# EAGLE design sensor_board_v0.53 (EAGLE 7.7.0)
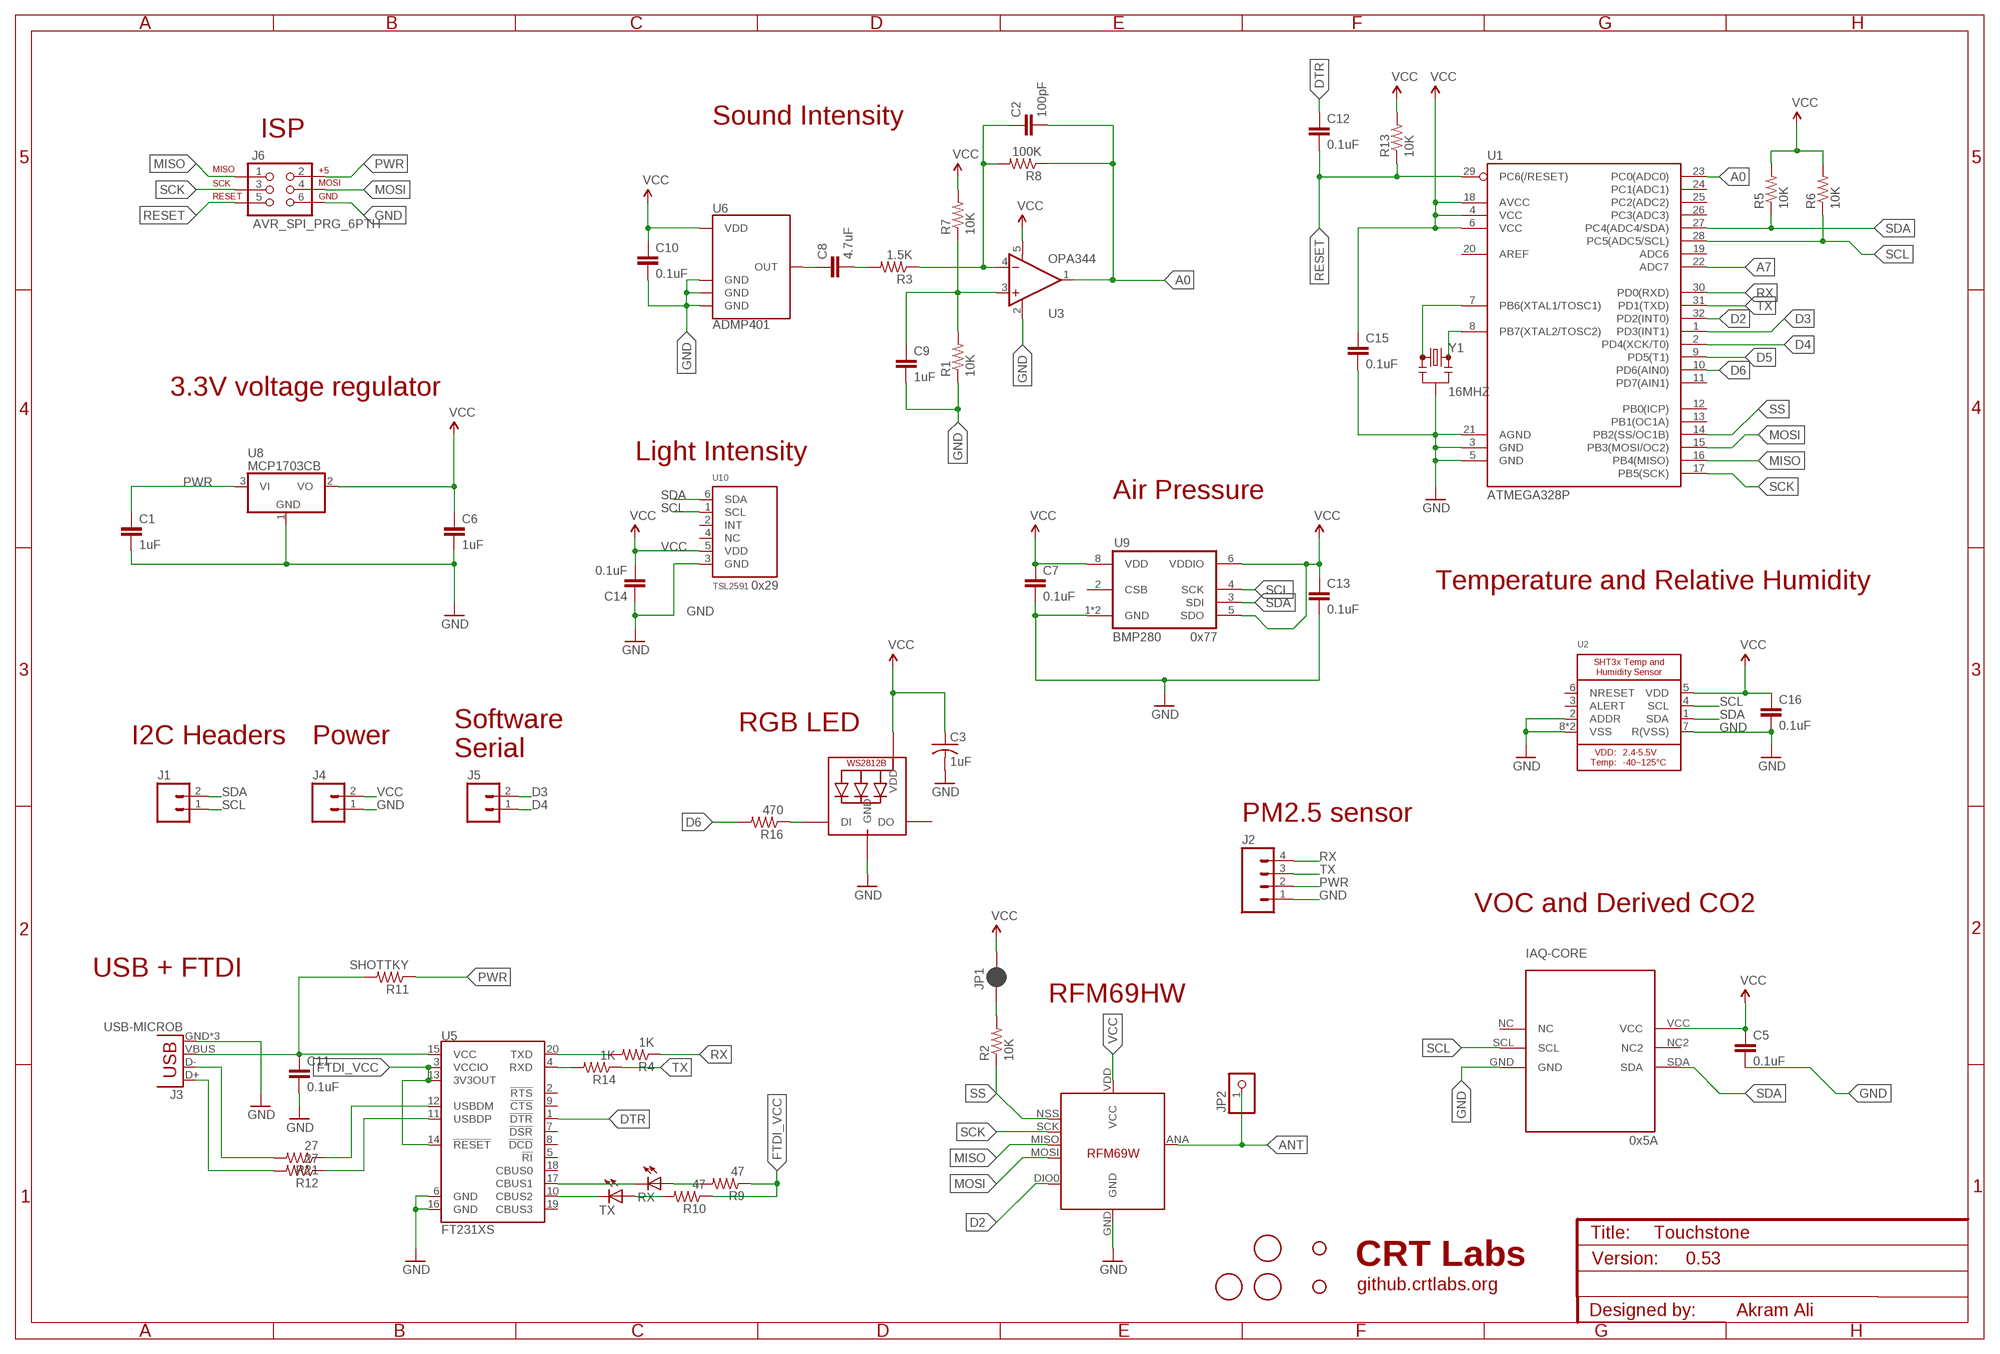
[diagram p0: schematic, sheet 1]

## Parts
C1  1uF  CAP0805  [0805]
C2  100pF  CAP0805  [0805]
C3  1uF  C-USC0603K  [C0603K]
C5  0.1uF  CAP0805  [0805]
C6  1uF  CAP0805  [0805]
C7  0.1uF  CAP0805  [0805]
C8  4.7uF  CAP0805  [0805]
C9  1uF  CAP0805  [0805]
C10  0.1uF  CAP0805  [0805]
C11  0.1uF  CAP0805  [0805]
C12  0.1uF  CAP0805  [0805]
C13  0.1uF  CAP0805  [0805]
C14  0.1uF  CAP0805  [0805]
C15  0.1uF  CAP0805  [0805]
C16  0.1uF  CAP0805  [0805]
H1  STAND-OFF  [STAND-OFF]
H2  STAND-OFF  [STAND-OFF]
IAQ-CORE  IAQ-CORE  [IAQ-CORE]
J1  M02PTH  [1X02]
J2  M04PTH  [1X04]
J3  USB-MICROB  [USB-MICROB]
J4  M02PTH  [1X02]
J5  M02PTH  [1X02]
J6  AVR_SPI_PRG_6PTH  [2X3]
JP1  JUMPER-PAD-2-NC_BY_PASTEFULL-BOX-SILK  [PAD-JUMPER-2-NC_BY_PASTE_YES_SILK_FULL_BOX]
JP2  PINHD-1X1  [1X01]
LED1  WS2812B3535  [LED3535]
R1  10K  RESISTOR0805-RES  [0805]
R2  10K  RESISTOR0805-RES  [0805]
R3  1.5K  RESISTOR0805-RES  [0805]
R4  1K  RESISTOR0805-RES  [0805]
R5  10K  RESISTOR0805-RES  [0805]
R6  10K  RESISTOR0805-RES  [0805]
R7  10K  RESISTOR0805-RES  [0805]
R8  100K  RESISTOR0805-RES  [0805]
R9  47  RESISTOR0805-RES  [0805]
R10  47  RESISTOR0805-RES  [0805]
R11  SHOTTKY  RESISTOR0805-RES  [0805]
R12  27  RESISTOR0805-RES  [0805]
R13  10K  RESISTOR0805-RES  [0805]
R14  1K  RESISTOR0805-RES  [0805]
R16  470  R-US_R0603  [R0603]
R21  27  RESISTOR0805-RES  [0805]
RX  LEDCHIPLED_0805  [CHIPLED_0805]
TX  LEDCHIPLED_0805  [CHIPLED_0805]
U1  ATMEGA328P  ATMEGA328P_TQFP  [TQFP32-08]
U2  SHT3X  [SHT3X]
U3  OPA344  [SOT23-5]
U4  RFM69HW  LOWPOWERLAB_RFM69  [LOWPOWERLAB_RFM69W-MINPADS]
U5  FT231XS  [SSOP20_L]
U6  ADMP401  [ADMP401]
U8  MCP1703CB  [SOT23]
U9  BMP280  [BMP280]
U10  TSL2591  LIGHT_TSL2591  [DFN6_TAOS]
U$1  FIDUCIAL  [FIDUCIAL_1MM]
U$2  FIDUCIAL  [FIDUCIAL_1MM]
U$3  FIDUCIAL  [FIDUCIAL_1MM]
Y1  16MHZ  RESONATOR16MHZ  [RESONATOR-SMD]

## Nets
A0: C2.2 R8.1 U1.23(PC0(ADC0)) U3.1(OUT)
A7: U1.22(ADC7)
ANT: JP2.1 U4.ANA(ANT)
D2: U1.32(PD2(INT0)) U4.DIO0
D3: J5.2 U1.1(PD3(INT1))
D4: J5.1 U1.2(PD4(XCK/T0))
D5: U1.9(PD5(T1))
D6: R16.2 U1.10(PD6(AIN0))
DTR: C12.1 U5.1(!DTR)
FTDI_VCC: R9.1 R10.1 U5.3(VCCIO) U5.13(3V3OUT) U5.14(!RESET)
GND: C1.2 C3.2 C5.2 C6.2 C7.2 C9.2 C10.2 C11.2 C13.2 C14.1 C15.2 C16.2 IAQ-CORE.GND J2.1 J3.GND J3.MT1(GND) J3.MT2(GND) J4.1 J6.6 LED1.4(GND) R1.1 U1.3(GND) U1.5(GND) U1.21(AGND) U2.2(ADDR) U2.7(R(VSS)) U2.8(VSS) U2.THERMAL(VSS) U3.2(V-) U4.GND U5.6(GND) U5.16(GND) U6.2(GND) U6.4(GND) U6.6(GND) U8.1(GND) U9.1(GND) U9.7(GND) U10.3(GND) Y1.2
MISO: J6.1 U1.16(PB4(MISO)) U4.MISO
MOSI: J6.4 U1.15(PB3(MOSI/OC2)) U4.MOSI
N$1: JP1.1 R2.2
N$2: R14.2 U5.4(RXD)
N$3: R4.2 U5.20(TXD)
N$4: U1.8(PB7(XTAL2/TOSC2)) Y1.3
N$5: U1.7(PB6(XTAL1/TOSC1)) Y1.1
N$7: LED1.1(DI) R16.1
N$9: C8.2 R3.2
N$10: C2.1 R3.1 R8.2 U3.4(-IN)
N$11: C9.1 R1.2 R7.1 U3.3(+IN)
N$17: RX.C U5.17(CBUS1)
N$18: TX.C U5.10(CBUS2)
N$25: R21.1 U5.12(USBDM)
N$26: R12.1 U5.11(USBDP)
N$27: R9.2 RX.A
N$29: R10.2 TX.A
N$32: J3.D- R21.2
N$33: J3.D+ R12.2
OUT: C8.1 U6.1(OUT)
PWR: C1.1 J2.2 J6.2 R11.1 U8.3(VI)
RESET: C12.2 J6.5 R13.1 U1.29(PC6(/RESET))
RX: J2.4 R4.1 U1.30(PD0(RXD))
SCK: J6.3 U1.17(PB5(SCK)) U4.SCK
SCL: IAQ-CORE.SCL J1.1 R6.1 U1.28(PC5(ADC5/SCL)) U2.4(SCL) U9.4(SCK) U10.1(SCL)
SDA: IAQ-CORE.SDA J1.2 R5.1 U1.27(PC4(ADC4/SDA)) U2.1(SDA) U9.3(SDI) U10.6(SDA)
SS: R2.1 U1.14(PB2(SS/OC1B)) U4.NSS(SEL)
TX: J2.3 R14.1 U1.31(PD1(TXD))
VBUS: C11.1 J3.VBUS R11.2 U5.15(VCC)
VCC: C3.1 C5.1 C6.1 C7.1 C10.1 C13.1 C14.2 C15.1 C16.1 IAQ-CORE.VCC J4.2 JP1.2 LED1.2(VDD) R5.2 R6.2 R7.2 R13.2 U1.4(VCC) U1.6(VCC) U1.18(AVCC) U2.5(VDD) U3.5(V+) U4.VDD(VCC) U6.5(VDD) U8.2(VO) U9.5(SDO) U9.6(VDDIO) U9.8(VDD) U10.5(VDD)
Unconnected: IAQ-CORE.NC IAQ-CORE.NC2 LED1.3(DO) U1.11(PD7(AIN1)) U1.12(PB0(ICP)) U1.13(PB1(OC1A)) U1.19(ADC6) U1.20(AREF) U1.24(PC1(ADC1)) U1.25(PC2(ADC2)) U1.26(PC3(ADC3)) U2.3(ALERT) U2.6(NRESET) U5.2(!RTS) U5.5(!RI) U5.7(!DSR) U5.8(!DCD) U5.9(!CTS) U5.18(CBUS0) U5.19(CBUS3) U9.2(CSB) U10.2(INT) U10.4(NC)

## Notes on the sheet
- Sound Intensity
- ISP
- 3.3V voltage regulator
- Light Intensity
- Air Pressure
- 0x29 | Temperature and Relative Humidity
- 0x77
- RGB LED
- I2C Headers | Power
- Software
  Serial
- PM2.5 sensor
- VOC and Derived CO2
- USB + FTDI
- RFM69HW
- 0x5A
- Touchstone
- CRT Labs | 0.53
- github.crtlabs.org
- Akram Ali

## Library data of the parts
C1 C6 C9 = SparkFun-Capacitors:CAP: Capacitor Standard 0603 ceramic capacitor, and 0.1" leaded capacitor.; MPN: CC0805ZRY5V8BB105
C2 = SparkFun-Capacitors:CAP: Capacitor Standard 0603 ceramic capacitor, and 0.1" leaded capacitor.; MPN: CC0805JRNPOABN101
C3 = adafruit:C-US: CAPACITOR, American symbol; MPN: CC0805ZRY5V8BB105
C5 C7 C12-C16 = SparkFun-Passives:CAP: Capacitor Standard 0603 ceramic capacitor, and 0.1" leaded capacitor.; MPN: CC0805KRX7R9BB104
C8 = SparkFun-Capacitors:CAP: Capacitor Standard 0603 ceramic capacitor, and 0.1" leaded capacitor.; MPN: CC0805KKX7R6BB475
C10 C11 = SparkFun-Capacitors:CAP: Capacitor Standard 0603 ceramic capacitor, and 0.1" leaded capacitor.; MPN: CC0805KRX7R9BB104
H1 H2 = SparkFun-Electromechanical:STAND-OFF: #4 Stand Off This is the mechanical footprint for a #4 phillips button head screw. Use the keepout ring to avoid running the screw head into surrounding components. SKU : PRT-00447
IAQ-CORE = IAQ-CORE:IAQ-CORE; MPN: IAQ-CORE C; OC_NEWARK: 82Y5455
J1 J4 J5 = SparkFun-Connectors:M02: Standard 2-pin 0.1" header. Use with - straight break away headers ( PRT-00116) - right angle break away headers (PRT-00553) - swiss pins (PRT-00743) - machine pins (PRT-00117) - female headers (PRT-00115) Molex polarized connector foot print use with: PRT-08233 with associated crimp pins and housings. 2.54_SCREWTERM for use with PRT-10571. 3.5mm Screw Terminal footprints for PRT-08084 5mm Screw Terminal footprints for use with PRT-08432
J2 = SparkFun-Connectors:M04: Header 4 Standard 4-pin 0.1" header. Use with straight break away headers (SKU : PRT-00116), right angle break away headers (PRT-00553), swiss pins (PRT-00743), machine pins (PRT-00117), and female headers (PRT-00115). Molex polarized connector foot print use with SKU : PRT-08231 with associated crimp pins and housings. 1MM SMD Version SKU: PRT-10208; PROD_ID: CONN-09696
J3 = SparkFun-Connectors:USB: USB Connectors USB-B-PTH is fully proven SKU : PRT-00139/CONN-08278 USB-miniB is fully proven SKU : PRT-00587 USB-A-PCB is untested. USB-A-H is throughly reviewed, but untested. Spark Fun Electronics SKU : PRT-00437 USB-B-SMT is throughly reviewed, but untested. Needs silkscreen touching up. USB-A-S has not been used/tested USB-MB-H has not been used/tested USB-MICROB has been used. CONN-09505; MPN: 47346-0001; PROD_ID: CONN-09505
J6 = SparkFun-Connectors:AVR_SPI_PRG_6: AVR ISP 6 Pin This is the reduced ISP connector for AVR programming. Common on Arduino. This footprint will take up less PCB space and can be used with a 10-pin to 6-pin adapter such as SKU: BOB-08508 **Special note about "TEST_POINT" package. The stop mask is on the top side, so if you want your programming test points to be on the bottom of your board, make sure to place this package on the bottom side of the board. This also ensure that the orientation to program from the bottom side will be correct.
JP1 = SparkFun-Passives:JUMPER-PAD-2-NC_BY_PASTE
JP2 = adafruit:PINHD-1X1: Pin header 1x1 for 0.1" spacing With round pins
LED1 = adafruit:WS2812B; MPN: SK6812 mini
R1 R2 R7 R13 = SparkFun-Passives:RESISTOR: Resistor Basic schematic elements and footprints for 0603, 1206, and PTH resistors.; MPN: RC0805FR-0710KL
R3 = SparkFun-Passives:RESISTOR: Resistor Basic schematic elements and footprints for 0603, 1206, and PTH resistors.; MPN: RC0805FR-071K5L
R4 R14 = SparkFun-Passives:RESISTOR: Resistor Basic schematic elements and footprints for 0603, 1206, and PTH resistors.; MPN: RC0805FR-071KL
R5 R6 = SparkFun-Resistors:RESISTOR: Resistor Basic schematic elements and footprints for 0603, 1206, and PTH resistors.; MPN: RC0805FR-0710KL
R8 = SparkFun-Passives:RESISTOR: Resistor Basic schematic elements and footprints for 0603, 1206, and PTH resistors.; MPN: RC0805FR-07100KL
R9 R10 = SparkFun-Passives:RESISTOR: Resistor Basic schematic elements and footprints for 0603, 1206, and PTH resistors.; MPN: RC0805FR-0747RL
R11 = SparkFun-Passives:RESISTOR: Resistor Basic schematic elements and footprints for 0603, 1206, and PTH resistors.; MPN: SD0805S040S0R5; OC_NEWARK: unknown
R12 R21 = SparkFun-Passives:RESISTOR: Resistor Basic schematic elements and footprints for 0603, 1206, and PTH resistors.; MPN: RC0805FR-0727RL
R16 = adafruit:R-US_: RESISTOR, American symbol; MPN: RC0805FR-07470RL
RX TX = adafruit:LED: LED OSRAM: - CHIPLED LG R971, LG N971, LY N971, LG Q971, LY Q971, LO R971, LY R971 LH N974, LH R974 LS Q976, LO Q976, LY Q976 LO Q996 - Hyper CHIPLED LW Q18S LB Q993, LB Q99A, LB R99A - SideLED LS A670, LO A670, LY A670, LG A670, LP A670 LB A673, LV A673, LT A673, LW A673 LH A674 LY A675 LS A676, LA A676, LO A676, LY A676, LW A676 LS A679, LY A679, LG A679 - Hyper Micro SIDELED® LS Y876, LA Y876, LO Y876, LY Y876 LT Y87S - SmartLED LW L88C, LW L88S LB L89C, LB L89S, LG L890 LS L89K, LO L89K, LY L89K LS L896, LA L896, LO L896, LY L896 - TOPLED LS T670, LO T670, LY T670, LG T670, LP T670 LSG T670, LSP T670, LSY T670, LOP T670, LYG T670 LG T671, LOG T671, LSG T671 LB T673, LV T673, LT T673, LW T673 LH T674 LS T676, LA T676, LO T676, LY T676, LB T676, LH T676, LSB T676, LW T676 LB T67C, LV T67C, LT T67C, LS T67K, LO T67K, LY T67K, LW E67C LS E67B, LA E67B, LO E67B, LY E67B, LB E67C, LV E67C, LT E67C LW T67C LS T679, LY T679, LG T679 LS T770, LO T770, LY T770, LG T770, LP T770 LB T773, LV T773, LT T773, LW T773 LH T774 LS E675, LA E675, LY E675, LS T675 LS T776, LA T776, LO T776, LY T776, LB T776 LHGB T686 LT T68C, LB T68C - Hyper Mini TOPLED® LB M676 - Mini TOPLED Santana® LG M470 LS M47K, LO M47K, LY M47K Source: http://www.osram.convergy.de/; MPN: LG R971-KN-1; OC_NEWARK: unknown
U1 = SparkFun-DigitalIC:ATMEGA328P_TQFP; MPN: ATMEGA328PB-AU; OC_NEWARK: 58Y6083; PROD_ID: IC-09069; VALUE: ATMEGA328P_TQFP
U2 = Adafruit SHT31:SHT3X: SHT3x - Digital Temperature and Humidity Sensor Supply Voltage: 2.4-5.5V Humidity Accuracy: SHT30 = +/-3%RH, SHT31 = +/-2%RH Temperature Sensor: -40~125°C (+/-0.3°C from 10-55C); MPN: SHT35-DIS-B
U3 = SparkFun-AnalogIC:OPA344: Single gate rail-to-rail output op-amp. Inputs extend 300mV past rails.; MPN: OPA344NA/3K; PROD_ID: IC-08251
U4 = RFM69 USB Gateway:LOWPOWERLAB_RFM69; MPN: RFM69HW
U5 = SparkFun-DigitalIC:FT231X: FTDI FT231X Full Speed USB to Full-handshake UART This USB2.0 Full Speed IC offers a compact bridge to full handshake UART interfaces. The device is a UART, capable of operating up to 3MBaud, with low power consumption (8mA). The FT231X includes the complete FT-X series feature set and enables USB to be added into a system design quickly and easily over a UART interface.; MPN: FT231XQ-R; PROD_ID: IC-11524
U6 = SparkFun-Sensors:ADMP401: Omnidirection bottom-port MEMS microphone; MPN: INMP401ACEZ-R7
U8 = linear:MCP1703: 250 mA, 16V, Low Quiescent Current LDO Regulator Source: http://ww1.microchip.com/downloads/en/DeviceDoc/22049b.pdf; MPN: MCP1703T-2502E/CB; OC_NEWARK: 18T9177
U9 = bosch-bmp280:BMP280: The BMP280 is an absolute barometric pressure sensor especially designed for mobile applications. The sensor module is housed in an extremely compact 8-pin metal-lid LGA package with a footprint of only 2.0 × 2.5 mm2 and 0.95 mm package height. Its small dimensions and its low power consumption of 2.7 μA @1Hz allow the implementation in battery driven devices such as mobile phones, GPS modules or watches. The library has been designed by Richard Magdycz <https://www.facebook.com/groups/eaglecadsoftUK>; MPN: BMP280
U10 = TSL2591:LIGHT_TSL2591: TSL2591 Light-To-Digital Sensor; MPN: TSL25911FN
U$1-U$3 = adafruit:FIDUCIAL: For use by pick and place machines to calibrate the vision/machine, 1mm By microbuilder.eu
Y1 = SparkFun-FreqCtrl:RESONATOR: Resonator Small SMD resonator. Used, eg, on the Arduino Pro/ Pro Mini boards. 8MHz- XTAL-08895 16MHz- XTAL-08900; MPN: CSTCE16M0V53-R0; OC_NEWARK: unknown; PROD_ID: XTAL-08900

## Board
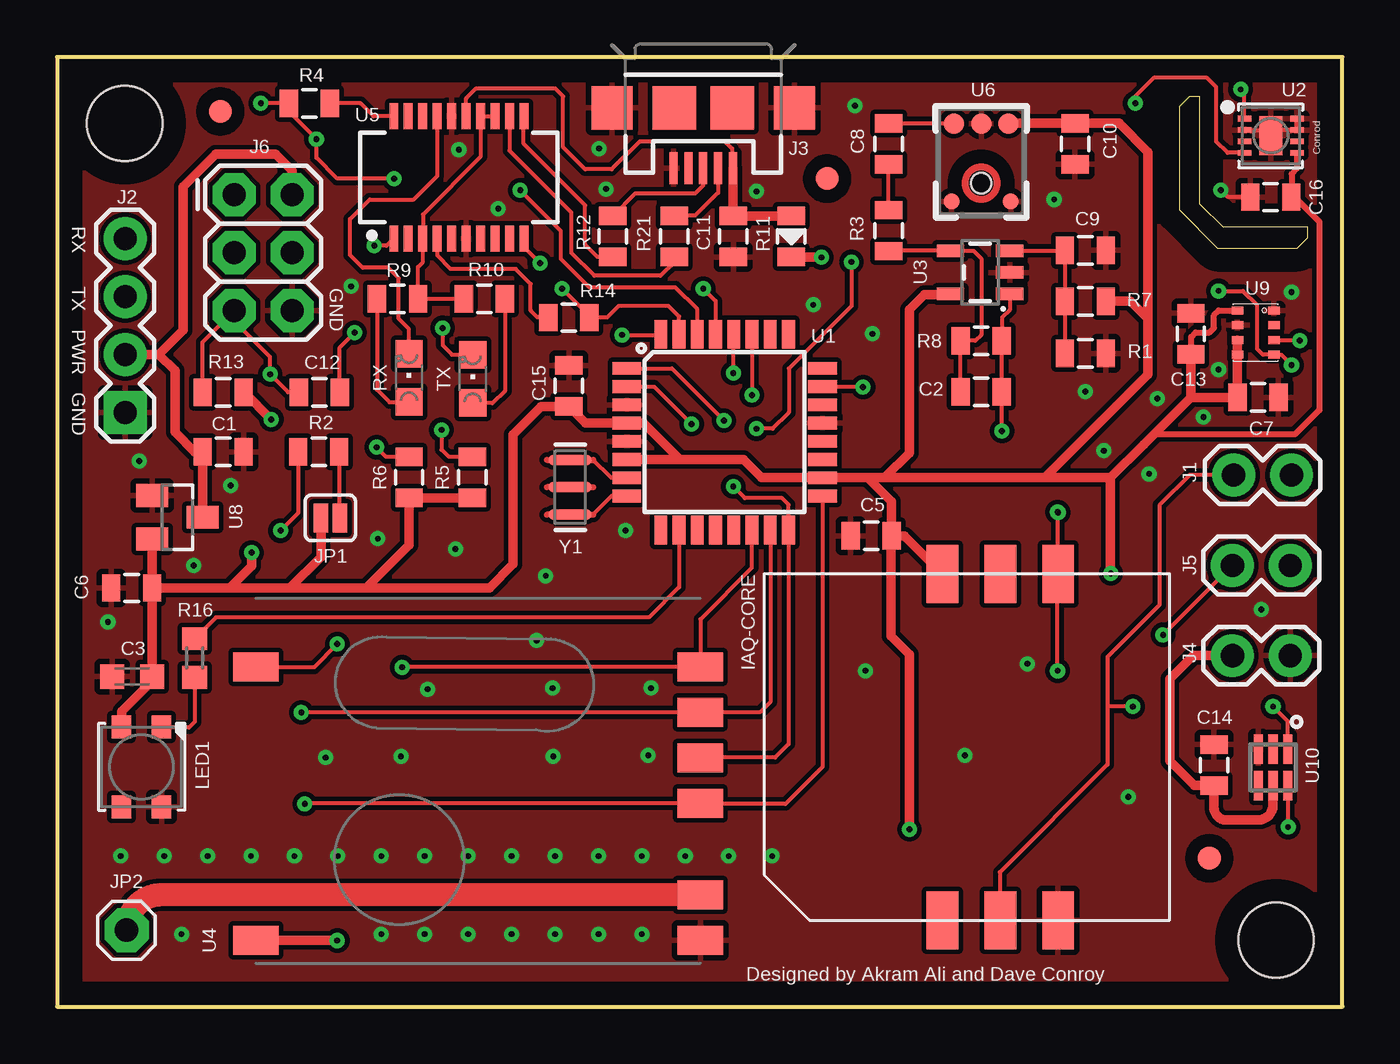
[diagram p1: board, top side]
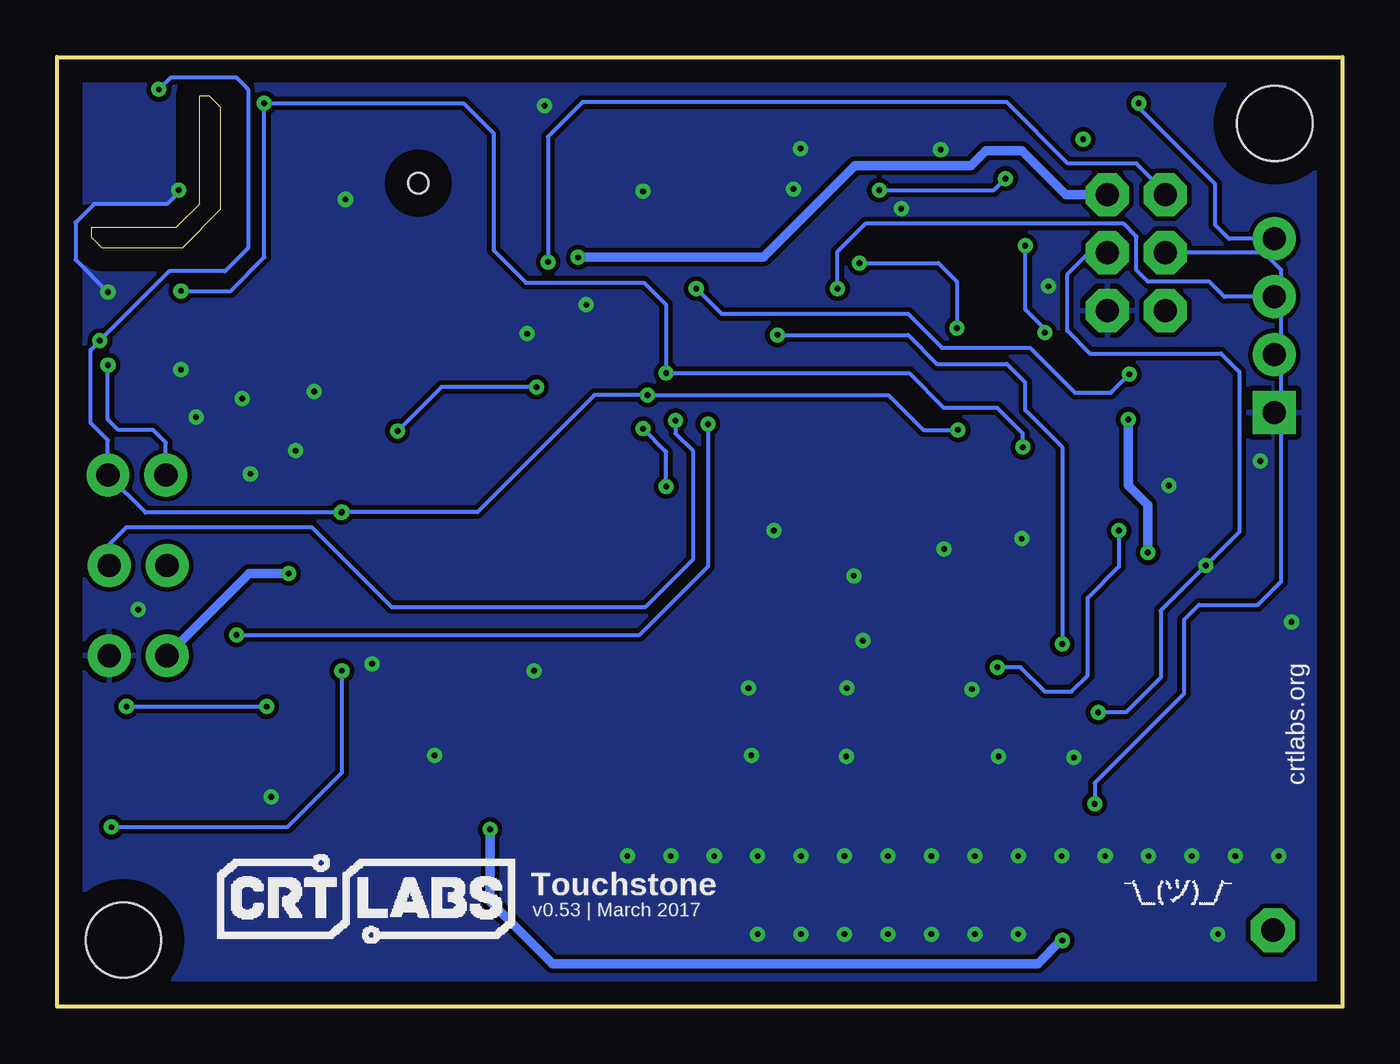
[diagram p2: board, bottom side, seen from below]

Size 56.39 x 41.66 mm. Coordinates in mm from the lower left corner, seen from the top.
Outline: 50.14,35.2 50.14,39.93 49.68,39.93 49.23,39.47 49.23,34.95 50.9,33.27 54.41,33.27 54.86,33.73 54.86,34.19 51.16,34.19 50.14,35.2
Outline: 0,41.66 0,0 56.39,0 56.39,41.66 0,41.66
Copper layers (1*16): Top 0.035mm / dielectric 1.5mm / Bottom 0.035mm
Design rules "default": minimum track width 10mil, minimum drill 24mil, track to track 8mil, track to pad 8mil, pad to pad 8mil, via to via 8mil, smd to smd 8mil, copper to edge 40mil, drill to drill 8mil, minimum pad ring 10mil, minimum via ring 8mil, stop-mask expansion 4mil, vias tented up to drill 0mil, thermal gap 10mil

### Footprints (pad centres in the part's own frame; a part is rotated, then mirrored left to right if it is on the bottom)
0805 = smd 0.8 x 1.2: 1 -0.9,0; 2 0.9,0
C0603K = smd 1.05 x 1.08: 1 -0.875,0; 2 0.875,0
STAND-OFF = hole 3.302: 0,0
IAQ-CORE = smd 2.54 x 1.4: GND 0,-12.9; NC 0,-7.82; NC2 15.2,-10.36; SCL 0,-10.36; SDA 15.2,-12.9; VCC 15.2,-7.82
1X02 = drill 1.016 pad 1.88: 1 0,0; 2 2.54,0
1X04 = drill 1.016 pad 1.88 square: 1 0,0 | drill 1.016 pad 1.88: 2 2.54,0; 3 5.08,0; 4 7.62,0
USB-MICROB = smd 0.35 x 1.4: D+ 0,2.65; D- -0.65,2.65; GND 1.3,2.65; ID 0.65,2.65; VBUS -1.3,2.65 | smd 1.8 x 1.9: MT1 -4,0; MT2 4,0 | smd 1.9 x 1.9: P$1 -1.27,0; P$2 1.27,0
2X3 = drill 1.016 pad 1.88 octagon: 1 0,0; 2 0,2.54; 3 2.54,0; 4 2.54,2.54; 5 5.08,0; 6 5.08,2.54
PAD-JUMPER-2-NC_BY_PASTE_YES_SILK_FULL_BOX = smd 0.635 x 1.27: 1 -0.412,0; 2 0.412,0
1X01 = drill 1.016 pad 1.93 octagon: 1 0,0
LED3535 = smd 1 x 0.85: 1 -1.75,0.875; 2 -1.75,-0.875; 3 1.75,-0.875; 4 1.75,0.875
R0603 = smd 1 x 1.1: 1 -0.85,0; 2 0.85,0
CHIPLED_0805 = smd 1.2 x 1.2: A 0,-1.05; C 0,1.05
TQFP32-08 = smd 1.27 x 0.559: 1 -4.293,2.8; 2 -4.293,2; 3 -4.293,1.2; 4 -4.293,0.4; 5 -4.293,-0.4; 6 -4.293,-1.2; 7 -4.293,-2; 8 -4.293,-2.8; 17 4.293,-2.8; 18 4.293,-2; 19 4.293,-1.2; 20 4.293,-0.4; 21 4.293,0.4; 22 4.293,1.2; 23 4.293,2; 24 4.293,2.8 | smd 0.559 x 1.27: 9 -2.8,-4.293; 10 -2,-4.293; 11 -1.2,-4.293; 12 -0.4,-4.293; 13 0.4,-4.293; 14 1.2,-4.293; 15 2,-4.293; 16 2.8,-4.293; 25 2.8,4.293; 26 2,4.293; 27 1.2,4.293; 28 0.4,4.293; 29 -0.4,4.293; 30 -1.2,4.293; 31 -2,4.293; 32 -2.8,4.293
SHT3X = smd 0.6 x 0.25: 1 -1.15,0.75; 2 -1.15,0.25; 3 -1.15,-0.25; 4 -1.15,-0.75; 5 1.15,-0.75; 6 1.15,-0.25; 7 1.15,0.25; 8 1.15,0.75 | smd 1 x 1.7: THERMAL 0,0
SOT23-5 = smd 0.55 x 1.2: 1 -0.95,-1.3; 2 0,-1.3; 3 0.95,-1.3; 4 0.95,1.3; 5 -0.95,1.3
LOWPOWERLAB_RFM69W-MINPADS = smd 2 x 1.27: ANA 8,-5; DIO0 -11.5,5; GND 8,-7; MISO 8,1; MOSI 8,3; NSS 8,5; SCK 8,-1; VDD -11.5,-7
SSOP20_L = smd 0.381 x 1.143: 1 -2.857,-2.68; 2 -2.223,-2.68; 3 -1.587,-2.68; 4 -0.953,-2.68; 5 -0.318,-2.68; 6 0.318,-2.68; 7 0.953,-2.68; 8 1.587,-2.68; 9 2.223,-2.68; 10 2.857,-2.68; 11 2.857,2.68; 12 2.223,2.68; 13 1.587,2.68; 14 0.953,2.68; 15 0.318,2.68; 16 -0.318,2.68; 17 -0.953,2.68; 18 -1.587,2.68; 19 -2.223,2.68; 20 -2.857,2.68
ADMP401 = smd 0.9 x 0.9: 1 -1.2,2.62; 5 1.2,2.62; 6 0,2.62 | smd 0.7 x 0.7: 2 1.3,-0.8; 4 -1.3,-0.8 | hole 0.9: 0,0
SOT23 = smd 1 x 1.4: 1 -0.95,-1.1; 2 0.95,-1.1; 3 0,1.1
BMP280 = smd 0.35 x 0.5: 1 0.975,-0.8; 2 0.325,-0.8; 3 -0.325,-0.8; 4 -0.975,-0.8; 5 -0.975,0.8; 6 -0.325,0.8; 7 0.325,0.8; 8 0.975,0.8
DFN6_TAOS = smd 1.3 x 0.4: 1 -0.8,0.65; 2 -0.8,0; 3 -0.8,-0.65; 4 0.8,-0.65; 5 0.8,0; 6 0.8,0.65
FIDUCIAL_1MM = smd 1 x 1: 1 0,0
RESONATOR-SMD = smd 0.45 x 1.905: 1 -1.2,0; 2 0,0; 3 1.2,0

### Placement (x,y rotation side)
C1  7.29,24.33 0 top
C2  40.54,26.97 0 top
C3  3.3,14.48 180 top
C5  35.71,20.65 180 top
C6  3.28,18.36 180 top
C7  52.68,26.72 0 top
C8  36.47,37.85 270 top
C9  45.11,33.17 0 top
C10  44.65,37.85 270 top
C11  29.67,33.78 270 top
C12  11.51,26.95 180 top
C13  49.73,29.51 90 top
C14  50.75,10.59 270 top
C15  22.45,27.23 90 top
C16  53.24,35.51 180 top
H1  2.97,38.73 0 top
H2  53.47,2.92 0 top
IAQ-CORE  31.01,3.78 90 top
J1  51.61,23.32 0 top
J2  3,26.06 90 top
J3  28.35,39.42 180 top
J4  54.1,15.39 180 top
J5  51.56,19.35 0 top
J6  7.77,35.61 270 top
JP1  11.99,21.44 180 top
JP2  3.05,3.35 0 top
LED1  3.71,10.52 270 top
R1  45.11,28.65 180 top
R2  11.48,24.33 0 top
R3  36.47,34.04 90 top
R4  11.07,39.62 0 top
R5  18.21,23.22 270 top
R6  15.44,23.22 270 top
R7  45.11,30.94 0 top
R8  40.54,29.21 180 top
R9  14.94,31.04 180 top
R10  18.75,31.04 0 top
R11  32.21,33.78 90 top
R12  24.38,33.78 90 top
R13  7.29,26.95 0 top
R14  22.45,30.23 180 top
R16  6.05,15.29 90 top
R21  27.08,33.78 90 top
RX  15.44,27.58 0 top
TX  18.24,27.53 0 top
U1  29.29,25.2 0 top
U2  53.24,38.2 0 top
U3  40.49,32.21 90 top
U4  20.22,9.91 0 top
U5  17.63,36.37 0 top
U6  40.54,36.12 0 top
U8  5.28,21.46 270 top
U9  52.58,29.57 90 top
U10  53.34,10.49 270 top
U$1  7.16,39.27 0 top
U$2  50.55,6.5 0 top
U$3  33.78,36.32 0 top
Y1  22.5,22.78 270 top

### Tracks (layer width: path | path; a pad name or v marks a point on that pad's centre or on a via)
A0  (via drill 0.25 pad 0.13)
  Top 0.178: U3.1 41.79,30.56 41.45,30.23 41.45,29.22 R8.1 C2.2 41.45,26.96 v41.45,25.25 | U1.23 35.34,27.2 v35.36,27.18
  Bottom 0.178: v35.36,27.18 39.52,27.18 v41.45,25.25
ANT
  Top 1.016: JP2.1 arc-90 4.6,4.91 U4.ANA
D2  (via drill 0.25 pad 0.13)
  Top 0.178: v12.29,15.9 11.28,14.88 8.74,14.88 U4.DIO0 | v24.79,29.46 26.46,29.46 U1.32
  Bottom 0.178: v24.79,29.46 19.05,29.46 17.78,28.19 14.73,28.19 13.92,27.38 13.92,26.16 12.29,24.54 v12.29,15.9
D3  (via drill 0.25 pad 0.13)
  Top 0.178: U1.1 26.97,28 v29.26,25.7
  Bottom 0.178: v29.26,25.7 29.26,25.15 28.5,24.38 28.5,19.61 30.58,17.53 41.71,17.53 45.21,21.03 53.34,21.03 54.1,20.27 J5.2
D4  (via drill 0.25 pad 0.13)
  Top 0.178: U1.2 26.19,27.2 v27.84,25.55 | J5.1 v48.51,16.31
  Bottom 0.178: v27.84,25.55 27.84,19.3 30.84,16.31 v48.51,16.31
D6
  Top 0.178: U1.10 27.29,18.4 25.96,17.07 6.97,17.07 R16.2
DTR  (via drill 0.25 pad 0.13)
  Top 0.178: U5.1 14.45,33.38 v13.92,33.38 | C12.1 12.41,28.92 v13.06,29.57
  Bottom 0.178: v13.92,33.38 13.92,30.58 13.06,29.72 v13.06,29.57
FTDI_VCC
  Top 0.178: U5.13 U5.14 18.58,37.27 16.05,34.75 16.05,33.71 U5.3 16.05,33.68 16.05,32.66 15.83,32.45 R9.1 R10.1
GND  (via drill 0.25 pad 0.13)
  Top 0.178: U2.2 52.99,38.45 U2.THERMAL 53.49,38.45 U2.7 U2.8 | C16.2 51.36,35.51 v51.05,35.81
  Bottom 0.178: v51.05,35.81 51.05,35.71 51.56,35.2 54.76,35.2 55.58,34.39 55.58,32.77 v54.15,31.34
  other vias: 19.35,35 17.63,37.59 48.26,26.67 45.11,26.97 47.9,23.37 45.92,24.38 50.29,25.86 23.77,37.64 24.08,35.86 30.68,35.76 16.26,13.92 46.99,9.19 35.46,14.73 33.17,30.78 42.57,15.04 43.74,35.41 35,39.52 24.94,20.88 17.48,20.07 14.07,20.52 7.62,22.86 27.56,6.6 25.65,6.6 23.75,6.6 21.84,6.6 19.94,6.6 18.03,6.6 16.13,6.6 14.22,6.6 12.32,6.6 10.41,6.6 8.51,6.6 25.65,3.17 23.75,3.17 21.84,3.17 19.94,3.17 18.03,3.17 16.13,3.17 14.22,3.17 6.6,6.6 29.46,6.6 31.37,6.6 21.44,18.9 5.99,19.35 21.03,16.05 35.76,29.51 25.93,11.02 21.77,10.97 15.09,10.97 11.79,10.92 26.06,13.97 21.74,13.97 3.61,23.93 2.24,16.87 4.7,6.6 2.79,6.6 5.46,3.17 50.95,27.94 39.83,11.02 52.83,17.42 12.9,31.6
  pour Top: -0.71,-0.46 57.02,-0.46 57.02,42.72 -0.71,42.72
  pour Bottom: -0.66,41.5 -0.66,-0.46 56.59,-0.46 56.59,42.72 -0.61,42.72 -0.61,41.5
MISO  (via drill 0.25 pad 0.13)
  Top 0.178: v34.85,32.66 34.85,30.73 32.11,27.99 32.11,26.06 31.39,25.35 v30.68,25.35 | v29.67,22.81 30.17,22.3 31.8,22.3 32.09,22.02 U1.16 32.09,11.51 31.5,10.92 28.23,10.92 U4.MISO
  Bottom 0.178: v34.85,32.66 34.85,38.15 33.33,39.67 14.73,39.67 12.04,36.98 9.04,36.98 7.77,35.71 J6.1 | v29.67,22.81 29.67,24.33 v30.68,25.35
MOSI  (via drill 0.25 pad 0.13)
  Top 0.178: U1.15 31.29,13.35 30.84,12.9 U4.MOSI | U4.MOSI | U4.MOSI v10.72,12.9
  Bottom 0.178: v10.72,12.9 9.5,12.9 7.98,14.43 7.98,17.37 4.52,20.83 4.52,27.84 5.33,28.65 11.07,28.65 12.09,29.67 12.09,32.11 11.12,33.07 J6.4 10.31,33.12
N$1
  Top 0.178: R2.2 12.38,21.46 JP1.1
N$2
  Top 0.178: U5.4 16.67,32.96 17.27,32.36 20.12,32.36 20.78,31.7 20.78,30.53 21.07,30.24 21.54,30.24 R14.2
N$3
  Top 0.178: U5.20 13.88,39.05 13.31,39.62 R4.2
N$4
  Top 0.178: U1.8 24.33,22.4 23.52,21.58
N$5
  Top 0.178: U1.7 24.31,23.2 23.52,23.98
N$7
  Top 0.178: R16.1 6.04,12.5 5.79,12.24 4.61,12.24 LED1.1
N$9
  Top 0.178: R3.2 C8.2
N$10
  Top 0.178: C2.1 R8.2 40.28,29.21 40.54,29.46 40.54,32.82 40.2,33.16 U3.4 36.5,33.16 R3.1
N$11
  Top 0.178: U3.3 44.2,33.16 C9.1 R7.1 R1.2
N$17
  Top 0.178: RX.C 15.44,29.72 14.99,30.17 14.99,31.95 14.53,32.41 13.41,32.41 12.85,32.97 12.85,34.54 13.72,35.41 15.65,35.41 16.67,36.44 U5.17
N$18  (via drill 0.25 pad 0.13)
  Top 0.178: U5.10 20.48,33.31 v21.18,32.61 | v16.92,29.77 16.92,29.01 17.32,28.6 18.22,28.6 TX.C
  Bottom 0.178: v21.18,32.61 17.73,32.61 16.92,31.8 v16.92,29.77
N$25
  Top 0.178: U5.12 19.85,37.55 22.55,34.85 22.55,33.07 23.57,32.05 26.47,32.05 27.08,32.66 R21.1
N$26
  Top 0.178: R12.1 23.71,32.88 23.16,33.43 23.16,35.15 20.47,37.85 20.47,39.04 U5.11
N$27
  Top 0.178: R9.2 14.04,27.06 14.58,26.52 15.43,26.52 RX.A
N$29
  Top 0.178: R10.2 19.65,27.01 19.1,26.47 18.25,26.47 TX.A
N$32
  Top 0.178: J3.D- 29,35.7 27.99,34.7 27.09,34.7 R21.2
N$33
  Top 0.178: J3.D+ 28.35,36.02 27.99,35.66 25.36,35.66 R12.2
OUT
  Top 0.178: C8.1 U6.1
PWR  (via drill 0.25 pad 0.13)
  Top 0.305: 32.22,32.87 R11.1
  Top 0.406: v33.53,32.87 32.22,32.87 | J6.2 10.31,36.68 9.6,37.39 6.96,37.39 5.54,35.97 5.54,29.67 4.47,28.6 | 4.47,28.6 J2.2 | U8.3 C1.1 6.04,24.33 5.18,25.2 5.18,27.89 4.47,28.6
  Bottom 0.406: v33.53,32.87 25.4,32.87 21.39,36.88 16.31,36.88 15.65,37.54 14.07,37.54 12.14,35.61 J6.2
RESET  (via drill 0.25 pad 0.13)
  Top 0.178: v28.35,31.5 28.89,30.96 U1.29 | R13.1 6.39,29.15 J6.5 7.77,30.07 9.35,28.5 v9.35,27.74 10.13,26.95 C12.2
  Bottom 0.178: 7.72,30.48 J6.5 | v9.35,27.74 10.16,26.92 11.73,26.92 13.72,28.91 17.58,28.91 19.05,30.38 27.23,30.38 v28.35,31.5
RX  (via drill 0.25 pad 0.13)
  Top 0.178: U1.30 28.09,30.59 27.13,31.55 23.37,31.55 22.1,32.82 22.1,34.04 v20.32,35.81 | v14.78,36.32 12.29,36.32 11.38,37.24 v11.38,38.05 10.17,39.25 R4.1 v8.94,39.62
  Bottom 0.178: v20.32,35.81 15.29,35.81 v14.78,36.32 | J2.4 4.98,33.68 5.59,34.29 5.59,36.07 8.94,39.42 v8.94,39.62
SCK  (via drill 0.25 pad 0.13)
  Top 0.178: U1.17 33.58,10.52 31.95,8.89 28.23,8.89 U4.SCK 10.89,8.91 v10.87,8.89
  Bottom 0.178: v10.87,8.89 10.87,9.8 6.96,13.72 6.96,16.97 6.3,17.63 3.71,17.63 2.69,18.64 2.69,32.31 3.45,33.07 J6.3
SCL  (via drill 0.25 pad 0.13)
  Top 0.178: R6.1 14.44,24.12 v14.02,24.54 | v29.67,27.79 29.67,29.47 U1.28 | v54.15,28.14 53.7,28.59 U9.4 52.89,28.59 52.63,28.85 52.63,30.78 52.02,31.39 v50.95,31.39 | v47.3,39.62 47.3,39.93 48.11,40.74 50.44,40.74 50.85,40.34 50.85,37.95 51.35,37.45 U2.4 | J1.1 49.68,23.32 48.36,22 48.36,17.63 46.08,15.34 46.08,13.21 | 46.08,13.21 46.08,10.62 41.35,5.89 41.35,3.81 IAQ-CORE.SCL | U10.1 53.99,12.51 v53.34,13.16 | v47.19,13.16 46.13,13.16 46.08,13.21
  Bottom 0.178: v14.02,24.54 14.02,25.15 15.14,26.26 17.48,26.26 19,27.79 v29.67,27.79 29.67,30.78 30.63,31.75 35.81,31.75 37.24,33.17 37.24,38.3 38.56,39.62 v47.3,39.62 47.3,32.87 48.77,31.39 v50.95,31.39 | J1.1 51.61,24.74 52.17,25.3 53.7,25.3 54.15,25.76 v54.15,28.14 | v53.34,13.16 v47.19,13.16
SDA  (via drill 0.25 pad 0.13)
  Top 0.178: U1.27 v30.49,26.83 v30.48,26.82 | v16.87,25.3 16.87,24.43 17.17,24.13 18.2,24.13 R5.1 | v54.51,29.21 53.41,29.21 U9.3 | v51.91,40.23 v51.92,40.23 52.09,40.06 U2.1 | v43.89,21.69 v43.91,21.67 IAQ-CORE.SDA 43.89,18.96 v43.89,14.73 | U10.6 53.99,7.88 v54,7.87
  Bottom 0.178: v30.48,26.82 19.91,26.82 18.39,25.3 v16.87,25.3 | 51.71,40.44 v51.92,40.23 51.41,40.74 48.51,40.74 48.01,40.23 48.01,33.27 49.02,32.26 51.46,32.26 v54.51,29.21 54.91,28.8 54.91,25.6 54.15,24.84 J1.2 52.51,21.67 v43.91,21.67 | v30.49,26.83 32.81,26.83 37.95,21.69 v43.89,21.69 | v54,7.87 46.28,7.87 43.89,10.26 v43.89,14.73
SS  (via drill 0.25 pad 0.13)
  Top 0.178: U1.14 30.48,19.25 28.22,16.99 U4.NSS 15.16,14.91 v15.14,14.88 | R2.1 10.58,21.65 v9.8,20.88
  Bottom 0.178: v15.14,14.88 14.12,14.88 13.06,13.82 11.89,13.82 11.18,14.53 11.18,17.93 9.8,19.3 v9.8,20.88
TX  (via drill 0.25 pad 0.13)
  Top 0.178: U1.31 27.29,30.27 26.82,30.73 24.64,30.73 24.13,30.23 R14.1 23.35,30.29 v22.15,31.5
  Bottom 0.178: J2.3 5.18,31.14 5.84,31.8 8.53,31.8 9.04,32.31 9.04,33.78 9.6,34.34 20.93,34.34 22.15,33.12 v22.15,31.5
VBUS
  Top 0.178: U5.15 17.95,39.84 18.39,40.28 21.84,40.28 22.2,39.93 22.2,37.69 23.16,36.73 24.33,36.73 25.55,37.95 29.31,37.95 29.62,37.64 29.62,36.8 J3.VBUS
  Top 0.305: 29.65,34.7 C11.1
  Top 0.406: J3.VBUS 29.65,34.7 | C11.1 R11.2
VCC  (via drill 0.25 pad 0.13)
  Top 0.254: 49.75,28.6 49.75,29.38 49.94,29.57 50.55,29.57 50.75,29.77 50.75,30.33 50.95,30.53 51.77,30.53 U9.8 | U2.5 54.39,36.76 54.15,36.52 54.15,35.52 C16.1 54.29,35.51 55.37,34.43 55.37,26.16 54.3,25.09 48.11,25.09 47.68,24.66
  Top 0.406: 13.56,18.36 18.97,18.36 20.02,19.41 20.02,25.09 21.23,26.31 22.44,26.31 C15.1 23.18,25.6 U1.4 25.73,25.6 27.33,24 | 13.56,18.36 15.44,20.24 R6.2 R5.2 | 35.56,23.2 U1.18 30.91,23.2 30.1,24 27.33,24 | 35.56,23.2 36.3,23.2 | 36.3,23.2 37.39,24.28 37.39,30.58 38.05,31.24 39.17,31.24 U3.5 | U1.6 27.33,24 | 36.3,23.2 43.33,23.2 | 43.33,23.2 46.21,23.2 | 49.73,26.72 C7.1 U9.5 U9.6 | 49.73,26.72 C13.1 49.75,28.6 | 46.21,23.2 47.68,24.66 49.73,26.72 | 47.85,30.17 47.85,37.49 46.6,38.75 C10.1 41.75,38.75 U6.5 | 47.85,30.17 47.85,27.72 43.33,23.2 | v12.29,2.9 12.28,2.91 U4.VDD | R7.2 47.09,30.94 47.85,30.17 | C3.1 | C3.1 4.17,14.47 4.17,14.27 2.85,12.95 2.85,12.28 LED1.2 | C5.1 37.17,20.65 IAQ-CORE.VCC | v37.39,7.77 37.39,15.44 36.58,16.26 36.58,20.61 C5.1 | C5.1 36.61,22.14 35.56,23.2 | 46.21,23.2 46.21,19.02 v46.23,19 | J4.2 49.84,15.39 48.82,14.38 48.82,10.77 49.89,9.7 50.74,9.7 C14.2 50.75,8.74 arc90 51.31,8.18 52.68,8.18 arc90 53.34,8.84 U10.5 | 13.56,18.36 10.21,18.36 | 10.21,18.36 7.57,18.36 | 7.57,18.36 C6.1 | U8.2 C6.1 | C3.1 C6.1 | C6.1 | JP1.2 11.58,19.73 10.21,18.36 | R13.2 v9.4,25.76 | v8.53,19.91 8.53,19.33 7.57,18.36
  Bottom 0.406: v12.29,2.9 12.34,2.9 13.36,1.88 34.65,1.88 37.39,4.62 v37.39,7.77 | v46.23,19 47.95,19 J4.2 | v9.4,25.76 9.4,22.86 8.53,22 v8.53,19.91

### Text on the board
_tsilk: Conrod | RX | TX | GND | PWR | GND | Designed by Akram Ali and Dave Conroy
_bsilk: crtlabs.org | Touchstone | v0.53 | March 2017